# Altium schematic sheet AdapterBoard.SchDoc
size A4; SheetNumber: 1; SheetTotal: 1
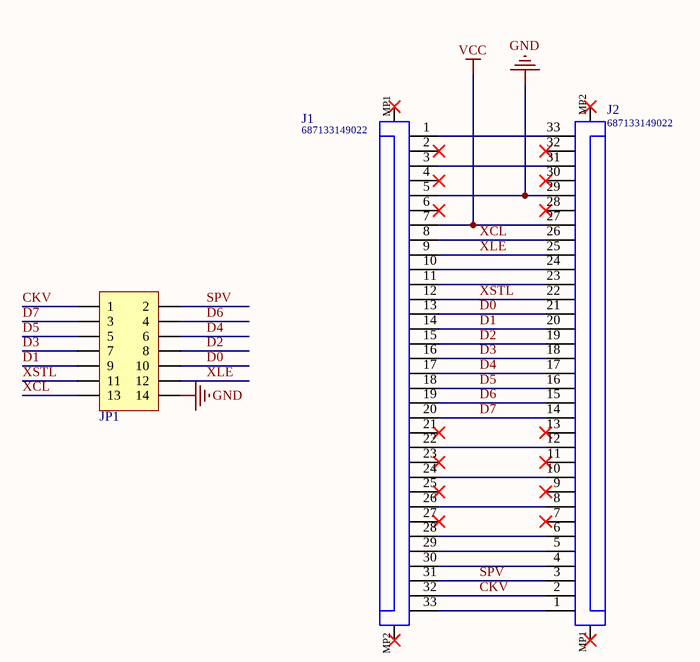
[diagram p0: AdapterBoard.SchDoc]

## Parts
J1  687133149022  [687133149022]
J2  687133149022  [687133149022]
JP1  Header 2X7  [HDR2.54-LI-2x7P]  (value not drawn)

## Nets
GND: J1.5 J2.29 JP1.14
VCC: J1.7 J2.27
CKV: J1.32 J2.2 JP1.1
D0: J1.13 J2.21 JP1.10
D1: J1.14 J2.20 JP1.9
D2: J1.15 J2.19 JP1.8
D3: J1.16 J2.18 JP1.7
D4: J1.17 J2.17 JP1.6
D5: J1.18 J2.16 JP1.5
D6: J1.19 J2.15 JP1.4
D7: J1.20 J2.14 JP1.3
SPV: J1.31 J2.3 JP1.2
XCL: J1.8 J2.26 JP1.13
XLE: J1.9 J2.25 JP1.12
XSTL: J1.12 J2.22 JP1.11
NetJ1_1: J1.1 J2.33
NetJ1_3: J1.3 J2.31
NetJ1_10: J1.10 J2.24
NetJ1_11: J1.11 J2.23
NetJ1_22: J1.22 J2.12
NetJ1_24: J1.24 J2.10
NetJ1_26: J1.26 J2.8
NetJ1_28: J1.28 J2.6
NetJ1_29: J1.29 J2.5
NetJ1_30: J1.30 J2.4
NetJ1_33: J1.33 J2.1

Not connected (* = marked no-connect by the designer): J1 2* 4* 6* 21* 23* 25* 27* MP1* MP2*; J2 7* 9* 11* 13* 28* 30* 32* MP1* MP2*

## Library data of the parts
J1 J2 = CMP-1502-01638-1: SMT ZIF Connectors Hinge Type WR-FPC, Horizontal, Bottom Contact, pitch 0.5 mm, 33 pins; Manufacturer: Wurth Elektronik; Working Voltage: 50VAC; Rated Current: 0.5A; Withstanding Voltage: 150VAC; Pitch: 0.5mm; Contact Resistance: 50mOhm; Pin Number: 33; Operating Temperature: -40to105degC; Manufacturer URL: http://www.we-online.de; Contact Design: BottomContact; Packaging: TapeandReel; Mounting Technology: SMT; Part Number: 687133149022; Orientation: Horizontal; Datasheet URL: https://katalog.we-online.de/em/datasheet/687133149022.pdf; Package Reference: 687133149022; Publisher: WurthElektronik
JP1 = Header 7X2: 7*2P接插件; 封装库来自淘宝卖家 ID：黄晶宝石: 其他店铺购入均为盗版假冒封装库; 联系卖家，免费查找封装: 唯一出售店铺网址https://shop463601444.taobao.com; BOM名称: 7*2P接插件